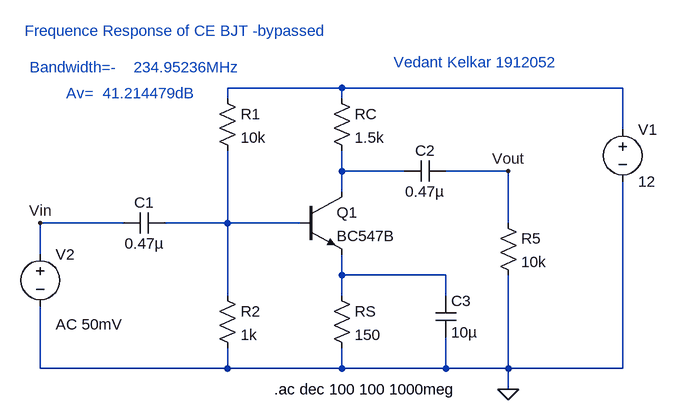
[diagram p0: schematic Frequency Response.asc]
Frequency Response.asc, the LTspice schematic file:
Version 4
SHEET 1 880 680
WIRE 208 -64 32 -64
WIRE 640 -64 208 -64
WIRE 32 -48 32 -64
WIRE 208 -48 208 -64
WIRE 640 0 640 -64
WIRE 208 64 208 32
WIRE 304 64 208 64
WIRE 464 64 368 64
WIRE 208 96 208 64
WIRE -128 144 -256 144
WIRE 32 144 32 32
WIRE 32 144 -64 144
WIRE 144 144 32 144
WIRE 464 144 464 64
WIRE -256 192 -256 144
WIRE 208 224 208 192
WIRE 368 224 208 224
WIRE 32 256 32 144
WIRE 208 256 208 224
WIRE 368 256 368 224
WIRE -256 368 -256 272
WIRE 32 368 32 336
WIRE 32 368 -256 368
WIRE 208 368 208 336
WIRE 208 368 32 368
WIRE 368 368 368 320
WIRE 368 368 208 368
WIRE 464 368 464 224
WIRE 464 368 368 368
WIRE 640 368 640 80
WIRE 640 368 464 368
WIRE 464 400 464 368
FLAG -256 144 Vin
FLAG 464 64 Vout
FLAG 464 400 0
SYMBOL npn 144 96 R0
SYMATTR InstName Q1
SYMATTR Value BC547B
SYMBOL res 192 -64 R0
SYMATTR InstName RC
SYMATTR Value 1.5k
SYMBOL res 16 -64 R0
SYMATTR InstName R1
SYMATTR Value 10k
SYMBOL res 16 240 R0
SYMATTR InstName R2
SYMATTR Value 1k
SYMBOL res 192 240 R0
SYMATTR InstName RS
SYMATTR Value 150
SYMBOL res 448 128 R0
SYMATTR InstName R5
SYMATTR Value 10k
SYMBOL cap 352 256 R0
SYMATTR InstName C3
SYMATTR Value 10µ
SYMBOL cap 368 48 R90
WINDOW 0 0 32 VBottom 2
WINDOW 3 32 32 VTop 2
SYMATTR InstName C2
SYMATTR Value 0.47µ
SYMBOL cap -64 128 R90
WINDOW 0 0 32 VBottom 2
WINDOW 3 32 32 VTop 2
SYMATTR InstName C1
SYMATTR Value 0.47µ
SYMBOL voltage -256 176 R0
WINDOW 123 24 124 Left 2
WINDOW 39 0 0 Left 0
SYMATTR Value2 AC 50mV
SYMATTR InstName V2
SYMATTR Value ""
SYMBOL voltage 640 -16 R0
WINDOW 123 0 0 Left 0
WINDOW 39 0 0 Left 0
SYMATTR InstName V1
SYMATTR Value 12
TEXT 104 400 Left 2 !.ac dec 100 100 1000meg
TEXT -280 -152 Left 2 ;Frequence Response of CE BJT -bypassed
TEXT 288 -104 Left 2 ;Vedant Kelkar 1912052
TEXT -160 -56 Left 2 ;41.214479dB
TEXT -216 -56 Left 2 ;Av=
TEXT -272 -96 Left 2 ;Bandwidth=-
TEXT -112 -96 Left 2 ;234.95236MHz

The netlist it stands for:
* Frequency Response.asc
Q1 N002 N003 N004 0 BC547B
RC N001 N002 1.5k
R1 N001 N003 10k
R2 N003 0 1k
RS N004 0 150
R5 Vout 0 10k
C3 N004 0 10µ
C2 Vout N002 0.47µ
C1 N003 Vin 0.47µ
V2 Vin 0 AC 50mV
V1 N001 0 12
.model NPN NPN
.model PNP PNP
.lib standard.bjt
.ac dec 100 100 1000meg
* Frequence Response of CE BJT -bypassed
* Vedant Kelkar 1912052
* 41.214479dB
* Av=
* Bandwidth=-
* 234.95236MHz
.backanno
.end